# EAGLE design board (EAGLE 7.5.0)
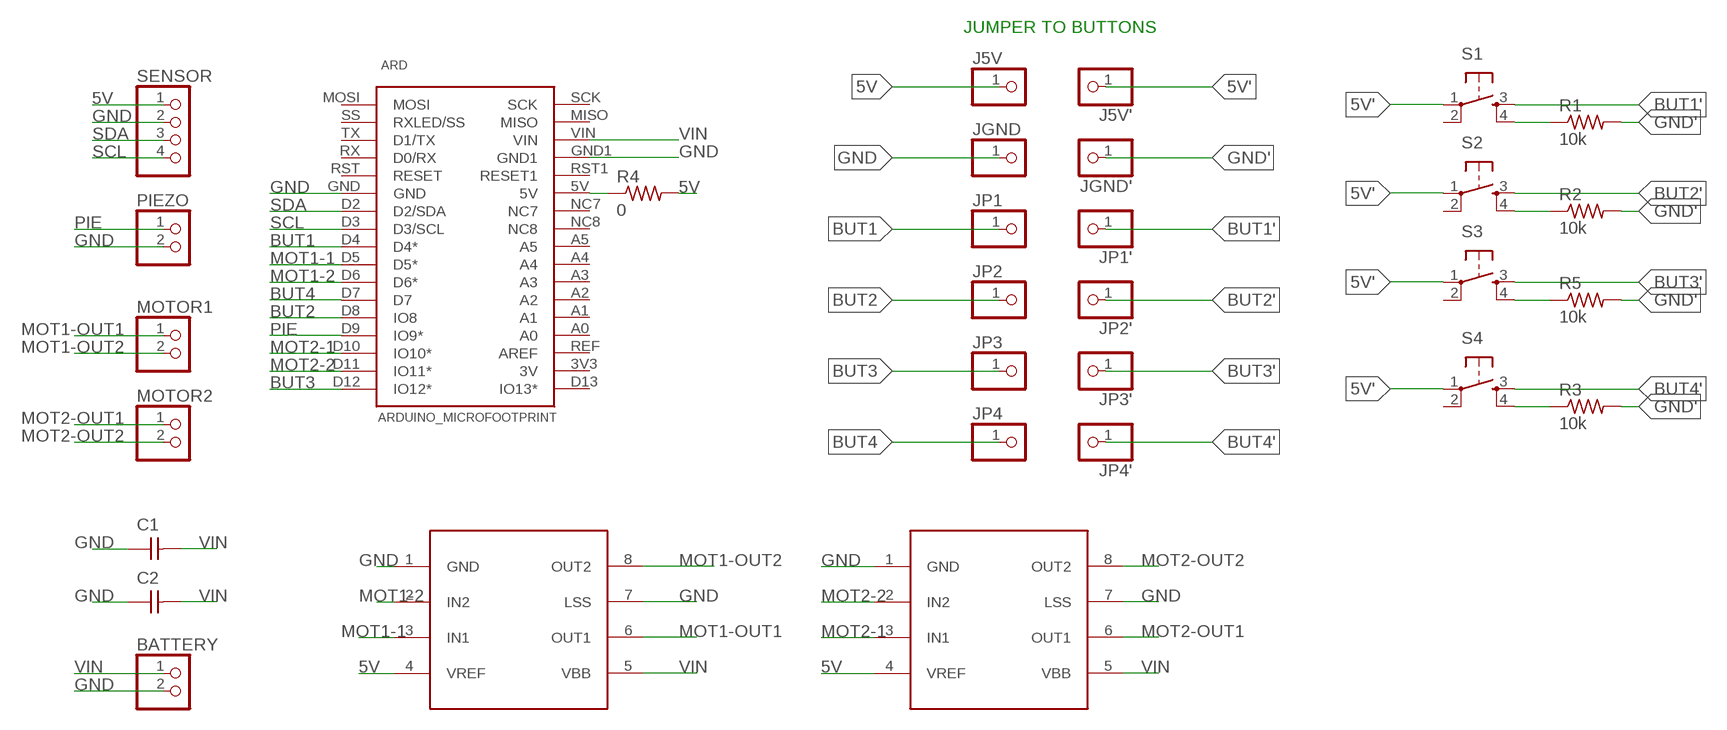
[diagram p0: schematic, sheet 1]

## Parts
ARD  ARDUINO_MICROFOOTPRINT  [ARDUINO-MICRO]
BATTERY  PINHD-1X2  [1X02]
C1  CAP-UNPOLARIZEDFAB  [C1206FAB]
C2  CAP-UNPOLARIZEDFAB  [C1206FAB]
J5V  PINHD-1X1  [1X01]
J5V'  PINHD-1X1  [1X01]
JGND  PINHD-1X1  [1X01]
JGND'  PINHD-1X1  [1X01]
JP1  PINHD-1X1  [1X01]
JP1'  PINHD-1X1  [1X01]
JP2  PINHD-1X1  [1X01]
JP2'  PINHD-1X1  [1X01]
JP3  PINHD-1X1  [1X01]
JP3'  PINHD-1X1  [1X01]
JP4  PINHD-1X1  [1X01]
JP4'  PINHD-1X1  [1X01]
MOT1  A4953-H-BRIDGE-MOTOR-DRIVER  [SOIC8]
MOT2  A4953-H-BRIDGE-MOTOR-DRIVER  [SOIC8]
MOTOR1  PINHD-1X2  [1X02]
MOTOR2  PINHD-1X2  [1X02]
PIEZO  PINHD-1X2  [1X02]
R1  10k  RES-US1206FAB  [R1206FAB]
R2  10k  RES-US1206FAB  [R1206FAB]
R3  10k  RES-US1206FAB  [R1206FAB]
R4  0  RES-US1206FAB  [R1206FAB]
R5  10k  RES-US1206FAB  [R1206FAB]
S1  6MM_SWITCH6MM_SWITCH  [6MM_SWITCH]
S2  6MM_SWITCH6MM_SWITCH  [6MM_SWITCH]
S3  6MM_SWITCH6MM_SWITCH  [6MM_SWITCH]
S4  6MM_SWITCH6MM_SWITCH  [6MM_SWITCH]
SENSOR  PINHD-1X4  [1X04]

## Nets
5V: J5V.1 MOT1.4(VREF) MOT2.4(VREF) R4.2 SENSOR.1
5V': J5V'.1 S1.1(P) S2.1(P) S3.1(P) S4.1(P)
BUT1: ARD.D4(D4*) JP1.1
BUT1': JP1'.1 S1.3(S)
BUT2: ARD.D8(IO8) JP2.1
BUT2': JP2'.1 S2.3(S)
BUT3: ARD.D12(IO12*) JP3.1
BUT3': JP3'.1 S3.3(S)
BUT4: ARD.D7 JP4.1
BUT4': JP4'.1 S4.3(S)
GND: ARD.GND ARD.GND1 BATTERY.2 C1.1 C2.1 JGND.1 MOT1.1(GND) MOT1.7(LSS) MOT2.1(GND) MOT2.7(LSS) PIEZO.2 SENSOR.2
GND': JGND'.1 R1.2 R2.2 R3.2 R5.2
MOT1-1: ARD.D5(D5*) MOT1.3(IN1)
MOT1-2: ARD.D6(D6*) MOT1.2(IN2)
MOT1-OUT1: MOT1.6(OUT1) MOTOR1.1
MOT1-OUT2: MOT1.8(OUT2) MOTOR1.2
MOT2-1: ARD.D10(IO10*) MOT2.3(IN1)
MOT2-2: ARD.D11(IO11*) MOT2.2(IN2)
MOT2-OUT1: MOT2.6(OUT1) MOTOR2.1
MOT2-OUT2: MOT2.8(OUT2) MOTOR2.2
N$1: R3.1 S4.4(S1)
N$3: ARD.5V R4.1
N$7: R1.1 S1.4(S1)
N$9: R2.1 S2.4(S1)
N$11: R5.1 S3.4(S1)
PIE: ARD.D9(IO9*) PIEZO.1
SCL: ARD.D3(D3/SCL) SENSOR.4
SDA: ARD.D2(D2/SDA) SENSOR.3
VIN: ARD.VIN BATTERY.1 C1.2 C2.2 MOT1.5(VBB) MOT2.5(VBB)
Unconnected: ARD.3V3(3V) ARD.A0 ARD.A1 ARD.A2 ARD.A3 ARD.A4 ARD.A5 ARD.D13(IO13*) ARD.MISO ARD.MOSI ARD.NC7 ARD.NC8 ARD.REF(AREF) ARD.RST1(RESET1) ARD.RST(RESET) ARD.RX(D0/RX) ARD.SCK ARD.SS(RXLED/SS) ARD.TX(D1/TX) S1.2(P1) S2.2(P1) S3.2(P1) S4.2(P1)

## Notes on the sheet
- JUMPER TO BUTTONS

## Library data of the parts
ARD = arduino-micro:ARDUINO_MICRO
BATTERY MOTOR1 MOTOR2 PIEZO = pinhead:PINHD-1X2: PIN HEADER
C1 C2 = fab:CAP-UNPOLARIZED
J5V J5V' JGND JGND' JP1 JP1' JP2 JP2' JP3 JP3' JP4 JP4' = pinhead:PINHD-1X1: PIN HEADER
MOT1 MOT2 = fab:A4953-H-BRIDGE-MOTOR-DRIVER
R1-R5 = fab:RES-US: Resistor (US Symbol) Variants with postfix FAB are widened to allow the routing of internal traces
S1-S4 = fab:6MM_SWITCH: OMRON SWITCH
SENSOR = pinhead:PINHD-1X4: PIN HEADER

## Board
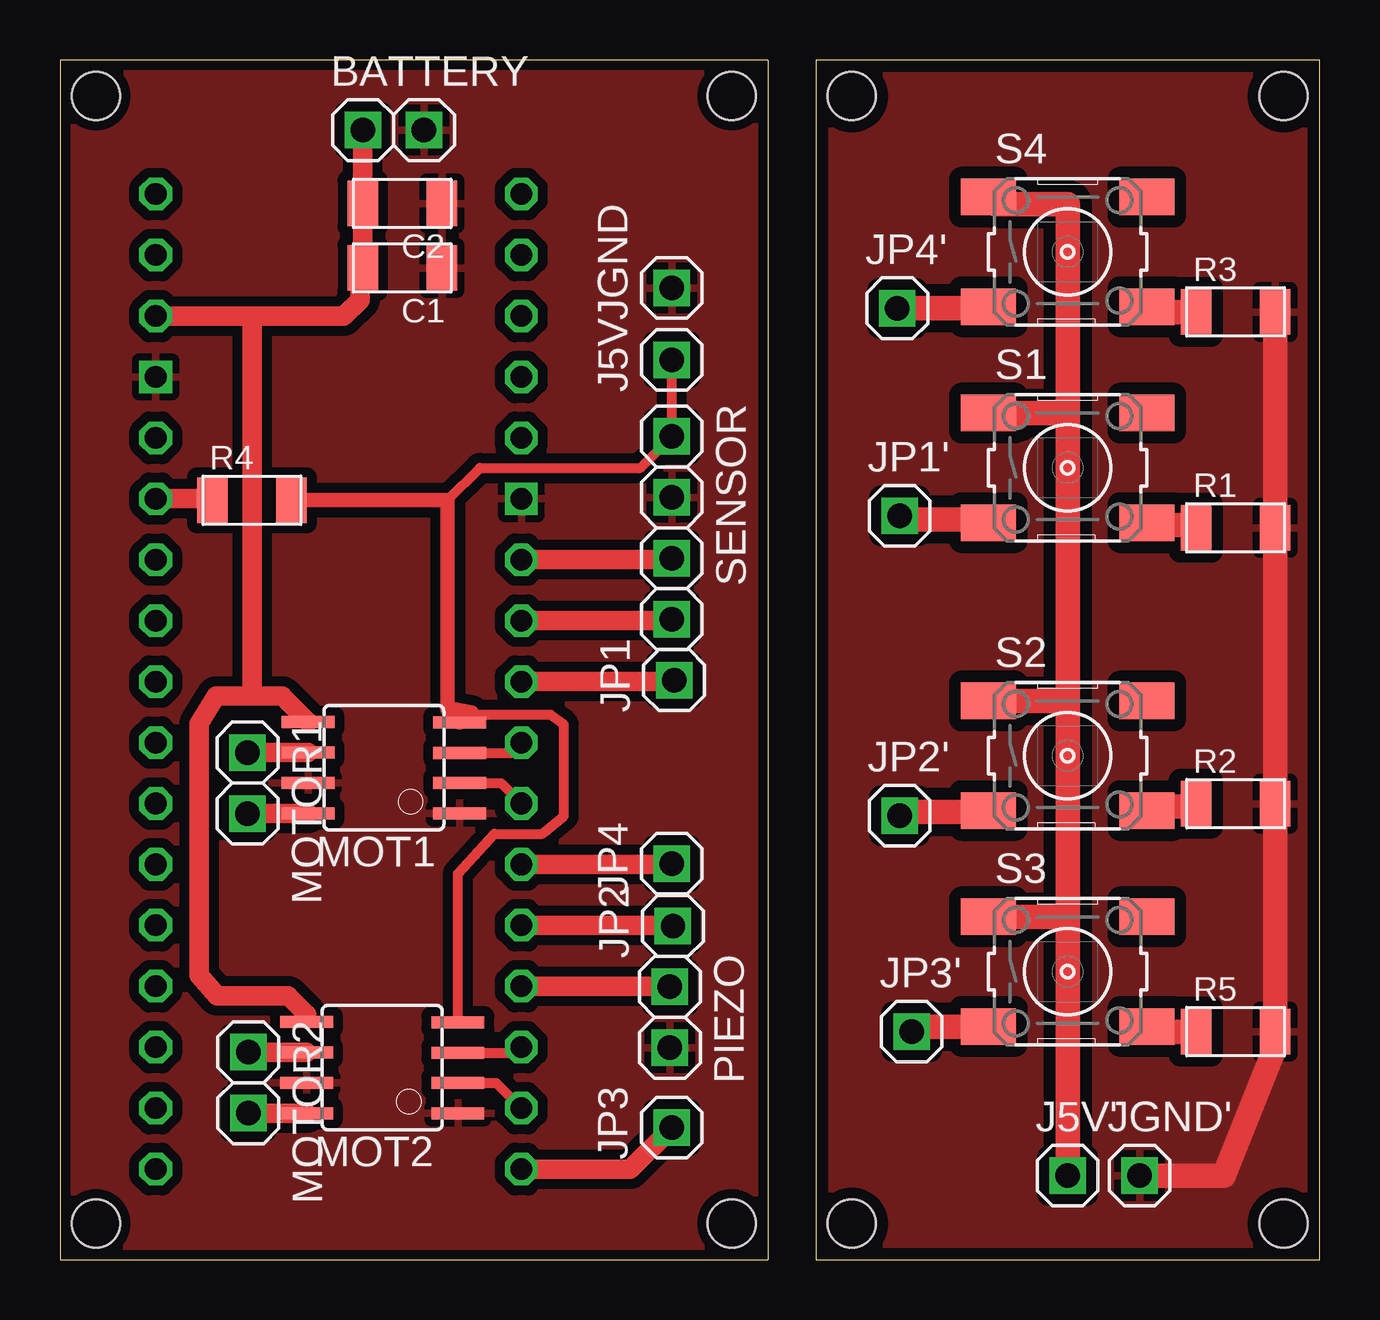
[diagram p1: board, top side]

Size 52.5 x 50 mm. Coordinates in mm from the lower left corner, seen from the top.
Outline: 0,0 29.5,0 29.5,50 0,50 0,0
Outline: 52.5,0 52.5,50 31.5,50 31.5,0 52.5,0
Copper layers (1*2+3*4+5*6+7*16): Top 0.035mm / dielectric 0.2mm / layer 2 0.035mm / dielectric 0.15mm / layer 3 0.035mm / dielectric 0.2mm / layer 4 0.035mm / dielectric 0.15mm / layer 5 0.035mm / dielectric 0.2mm / layer 6 0.035mm / dielectric 0.15mm / layer 7 0.035mm / dielectric 0.2mm / Bottom 0.035mm
Design rules "Eagle_WEdirekt_150_check": minimum track width 6mil, minimum drill 0.25mm, track to track 6mil, track to pad 8mil, pad to pad 8mil, via to via 6mil, smd to smd 8mil, copper to edge 12mil, drill to drill 24mil, minimum pad ring 9mil, minimum via ring 9mil, stop-mask expansion 3mil, vias tented up to drill 0mil, thermal gap 12mil
Holes 2 mm at 33,48.5 51,48.5 51,1.5 33,1.5 1.5,1.5 1.5,48.5 28,48.5 28,1.5

### Footprints (pad centres in the part's own frame; a part is rotated, then mirrored left to right if it is on the bottom)
ARDUINO-MICRO = drill 0.9 octagon: 3V3 16.51,3.81; 5V 16.51,29.21; A0 16.51,8.89; A1 16.51,11.43; A2 16.51,13.97; A3 16.51,16.51; A4 16.51,19.05; A5 16.51,21.59; D2 1.27,26.67; D3 1.27,24.13; D4 1.27,21.59; D5 1.27,19.05; D6 1.27,16.51; D7 1.27,13.97; D8 1.27,11.43; D9 1.27,8.89; D10 1.27,6.35; D11 1.27,3.81; D12 1.27,1.27; D13 16.51,1.27; MISO 16.51,39.37; MOSI 1.27,41.91; NC7 16.51,26.67; NC8 16.51,24.13; REF 16.51,6.35; RST 1.27,31.75; RST1 16.51,31.75; RX 1.27,34.29; SCK 16.51,41.91; SS 1.27,39.37; TX 1.27,36.83; VIN 16.51,36.83 | drill 0.9 square: GND 1.27,29.21; GND1 16.51,34.29
1X02 = drill 1.016 square: 1 -1.27,0; 2 1.27,0
C1206FAB = smd 1.27 x 1.905: 1 -1.651,0; 2 1.651,0
1X01 = drill 1.016 square: 1 0,0
SOIC8 = smd 0.5 x 2.2: 1 -1.905,-3.154; 2 -0.645,-3.154; 3 0.625,-3.154; 4 1.895,-3.154; 5 1.905,3.154; 6 0.635,3.154; 7 -0.635,3.154; 8 -1.905,3.154
R1206FAB = smd 1.27 x 1.905: 1 -1.651,0; 2 1.651,0
6MM_SWITCH = smd 2.286 x 1.524: 1 -3.302,2.286; 2 3.302,2.286; 3 -3.302,-2.286; 4 3.302,-2.286
1X04 = drill 1.016 square: 1 -3.81,0; 2 -1.27,0; 3 1.27,0; 4 3.81,0

### Placement (x,y rotation side)
ARD  20.5,2.5 0 bottom
BATTERY  13.9,47.08 0 top
C1  14.27,41.33 180 top
C2  14.27,44.02 180 top
J5V  25.5,37.5 90 top
J5V'  42,3.5 0 top
JGND  25.5,40.5 90 top
JGND'  45,3.5 0 top
JP1  25.6,24.15 90 top
JP1'  35,31 0 top
JP2  25.55,13.9 90 top
JP2'  35,18.5 0 top
JP3  25.5,5.5 90 top
JP3'  35.5,9.5 0 top
JP4  25.5,16.5 90 top
JP4'  34.9,39.65 0 top
MOT1  13.5,20.5 90 top
MOT2  13.43,8 90 top
MOTOR1  7.82,19.86 270 top
MOTOR2  7.85,7.37 270 top
PIEZO  25.42,10.1 270 top
R1  49,30.5 0 top
R2  49,19 0 top
R3  49,39.5 0 top
R4  8,31.65 0 top
R5  49,9.5 0 top
S1  42,33 0 top
S2  42,21 0 top
S3  42,12 0 top
S4  42,42 0 top
SENSOR  25.5,30.5 270 top

### Tracks (layer width: path | path; a pad name or v marks a point on that pad's centre or on a via)
5V
  Top 0.406: J5V.1 SENSOR.1 24.19,33 17.5,33 16.15,31.65 | MOT2.4 16.58,16.08 18.1,17.75 20.1,17.75 21,18.5 21,22.3 20.45,22.7 17.35,22.7 17.15,22.8
  Top 0.61: R4.2 16.15,31.65 16.15,23 | 16.15,23 16.15,22.9 MOT1.4 | 17.15,22.8 16.15,23
5V'
  Top 0.813: 39.94,35 38.98,35 S1.1 | 38.98,44 S4.1 | 41.79,35.29 42,35.5 | 41.71,23.29 42,23 | 41.71,14.29 42,14
  Top 1.016: 38.98,44 42,44 42,35.5 42,23 42,14 J5V'.1 | S1.1 41.79,35.29 | S2.1 41.71,23.29 | S3.1 41.71,14.29
BUT1
  Top 0.406: 25.54,24.09 JP1.1
  Top 0.813: ARD.D4 25.54,24.09
BUT1'
  Top 0.813: 38.67,30.85 38.5,30.85 38.5,30.71 S1.3 | 35,30.85 JP1'.1
  Top 1.016: 38.5,30.85 35,30.85
BUT2
  Top 0.406: 25.52,13.93 JP2.1
  Top 0.813: ARD.D8 25.52,13.93
BUT2'
  Top 0.813: 35,18.66 JP2'.1 | 38.7,18.66 S2.3
  Top 1.016: 38.7,18.66 35,18.66
BUT3
  Top 0.813: ARD.D12 23.77,3.77 JP3.1
BUT3'
  Top 0.813: 35.5,9.71 JP3'.1 | S3.3 38.67,9.71
  Top 1.016: 38.67,9.71 35.5,9.71
BUT4
  Top 0.406: 25.47,16.47 JP4.1
  Top 0.813: ARD.D7 25.47,16.47
BUT4'
  Top 0.813: 38.63,39.65 S4.3
  Top 1.016: JP4'.1 38.63,39.65
GND
  pour Top (isolate 0.42): 0,0 29.5,0 29.5,50 0,50
GND'
  Top 0.254: 50.81,9.23 R5.2
  Top 0.813: 50.5,8.5 50.5,9.35 R5.2
  Top 1.016: R5.2 R2.2 R1.2 R3.2 | 50.5,8.5 48.5,3.5 JGND'.1
  pour Top (isolate 0.5): 31.5,50 52.5,50 52.5,0 31.5,0
MOT1-1
  Top 0.406: MOT1.3 18.8,21.12 ARD.D5
MOT1-2
  Top 0.406: MOT1.2 18.39,19.86 ARD.D6
MOT1-OUT1
  Top 0.813: MOTOR1.1 MOT1.6
MOT1-OUT2
  Top 0.813: MOTOR1.2 MOT1.8
MOT2-1
  Top 0.406: MOT2.3 19,8.62 ARD.D10
MOT2-2
  Top 0.406: MOT2.2 18.18,7.36 ARD.D11
MOT2-OUT1
  Top 0.813: MOTOR2.1 MOT2.6
MOT2-OUT2
  Top 0.406: 9.77,6.1 MOT2.8
  Top 0.813: MOTOR2.2 MOT2.8
N$1
  Top 0.813: 45.52,39.5 S4.4
  Top 1.016: R3.1 45.52,39.5
N$3
  Top 0.813: ARD.5V 6.29,31.71 R4.1
N$7
  Top 0.813: 47.12,30.62 47,30.62 47.12,30.5 R1.1 | 45.3,30.62 S1.4
  Top 1.016: 47,30.62 45.3,30.62
N$9
  Top 0.813: S2.4 45.3,18.89 46,18.89 46,19 | 47.12,18.89 47,18.89 47,19 R2.1
  Top 1.016: 47,18.89 46,18.89
N$11
  Top 0.813: 45.52,9.5 S3.4
  Top 1.016: R5.1 45.52,9.5
PIE
  Top 0.406: 25.4,11.39 PIEZO.1
  Top 0.813: ARD.D9 25.4,11.39
SCL
  Top 0.813: ARD.D3 25.44,26.63 SENSOR.4
SDA
  Top 0.813: ARD.D2 25.44,29.17 SENSOR.3
VIN
  Top 0.406: 12.5,41.21 C1.2 | 12.62,47.07 BATTERY.1 | 8.33,39.33 8,39 | MOT2.5 10.28,10.22
  Top 0.813: ARD.VIN 8.33,39.33 11.83,39.33 12.5,40 12.5,41.21 | C1.2 C2.2 12.62,47.07 | 8,39 8,23.5 | 8,23.5 9.25,23.5 MOT1.5 | 10.28,10.22 9.5,11 6.55,11 5.8,11.85 5.8,22.35 6.5,23.5 8,23.5